# EasyEDA Pro project 02_PowerPart.epro

# Schematic Schematic2
Create Date: 2024-06-30; Page Name: P1; Project Name: 264母板; Schematic Name: Schematic2; Update Date: 2024-08-12; Company: 嘉立创EDA; Page Size: A3; Version: V1.0
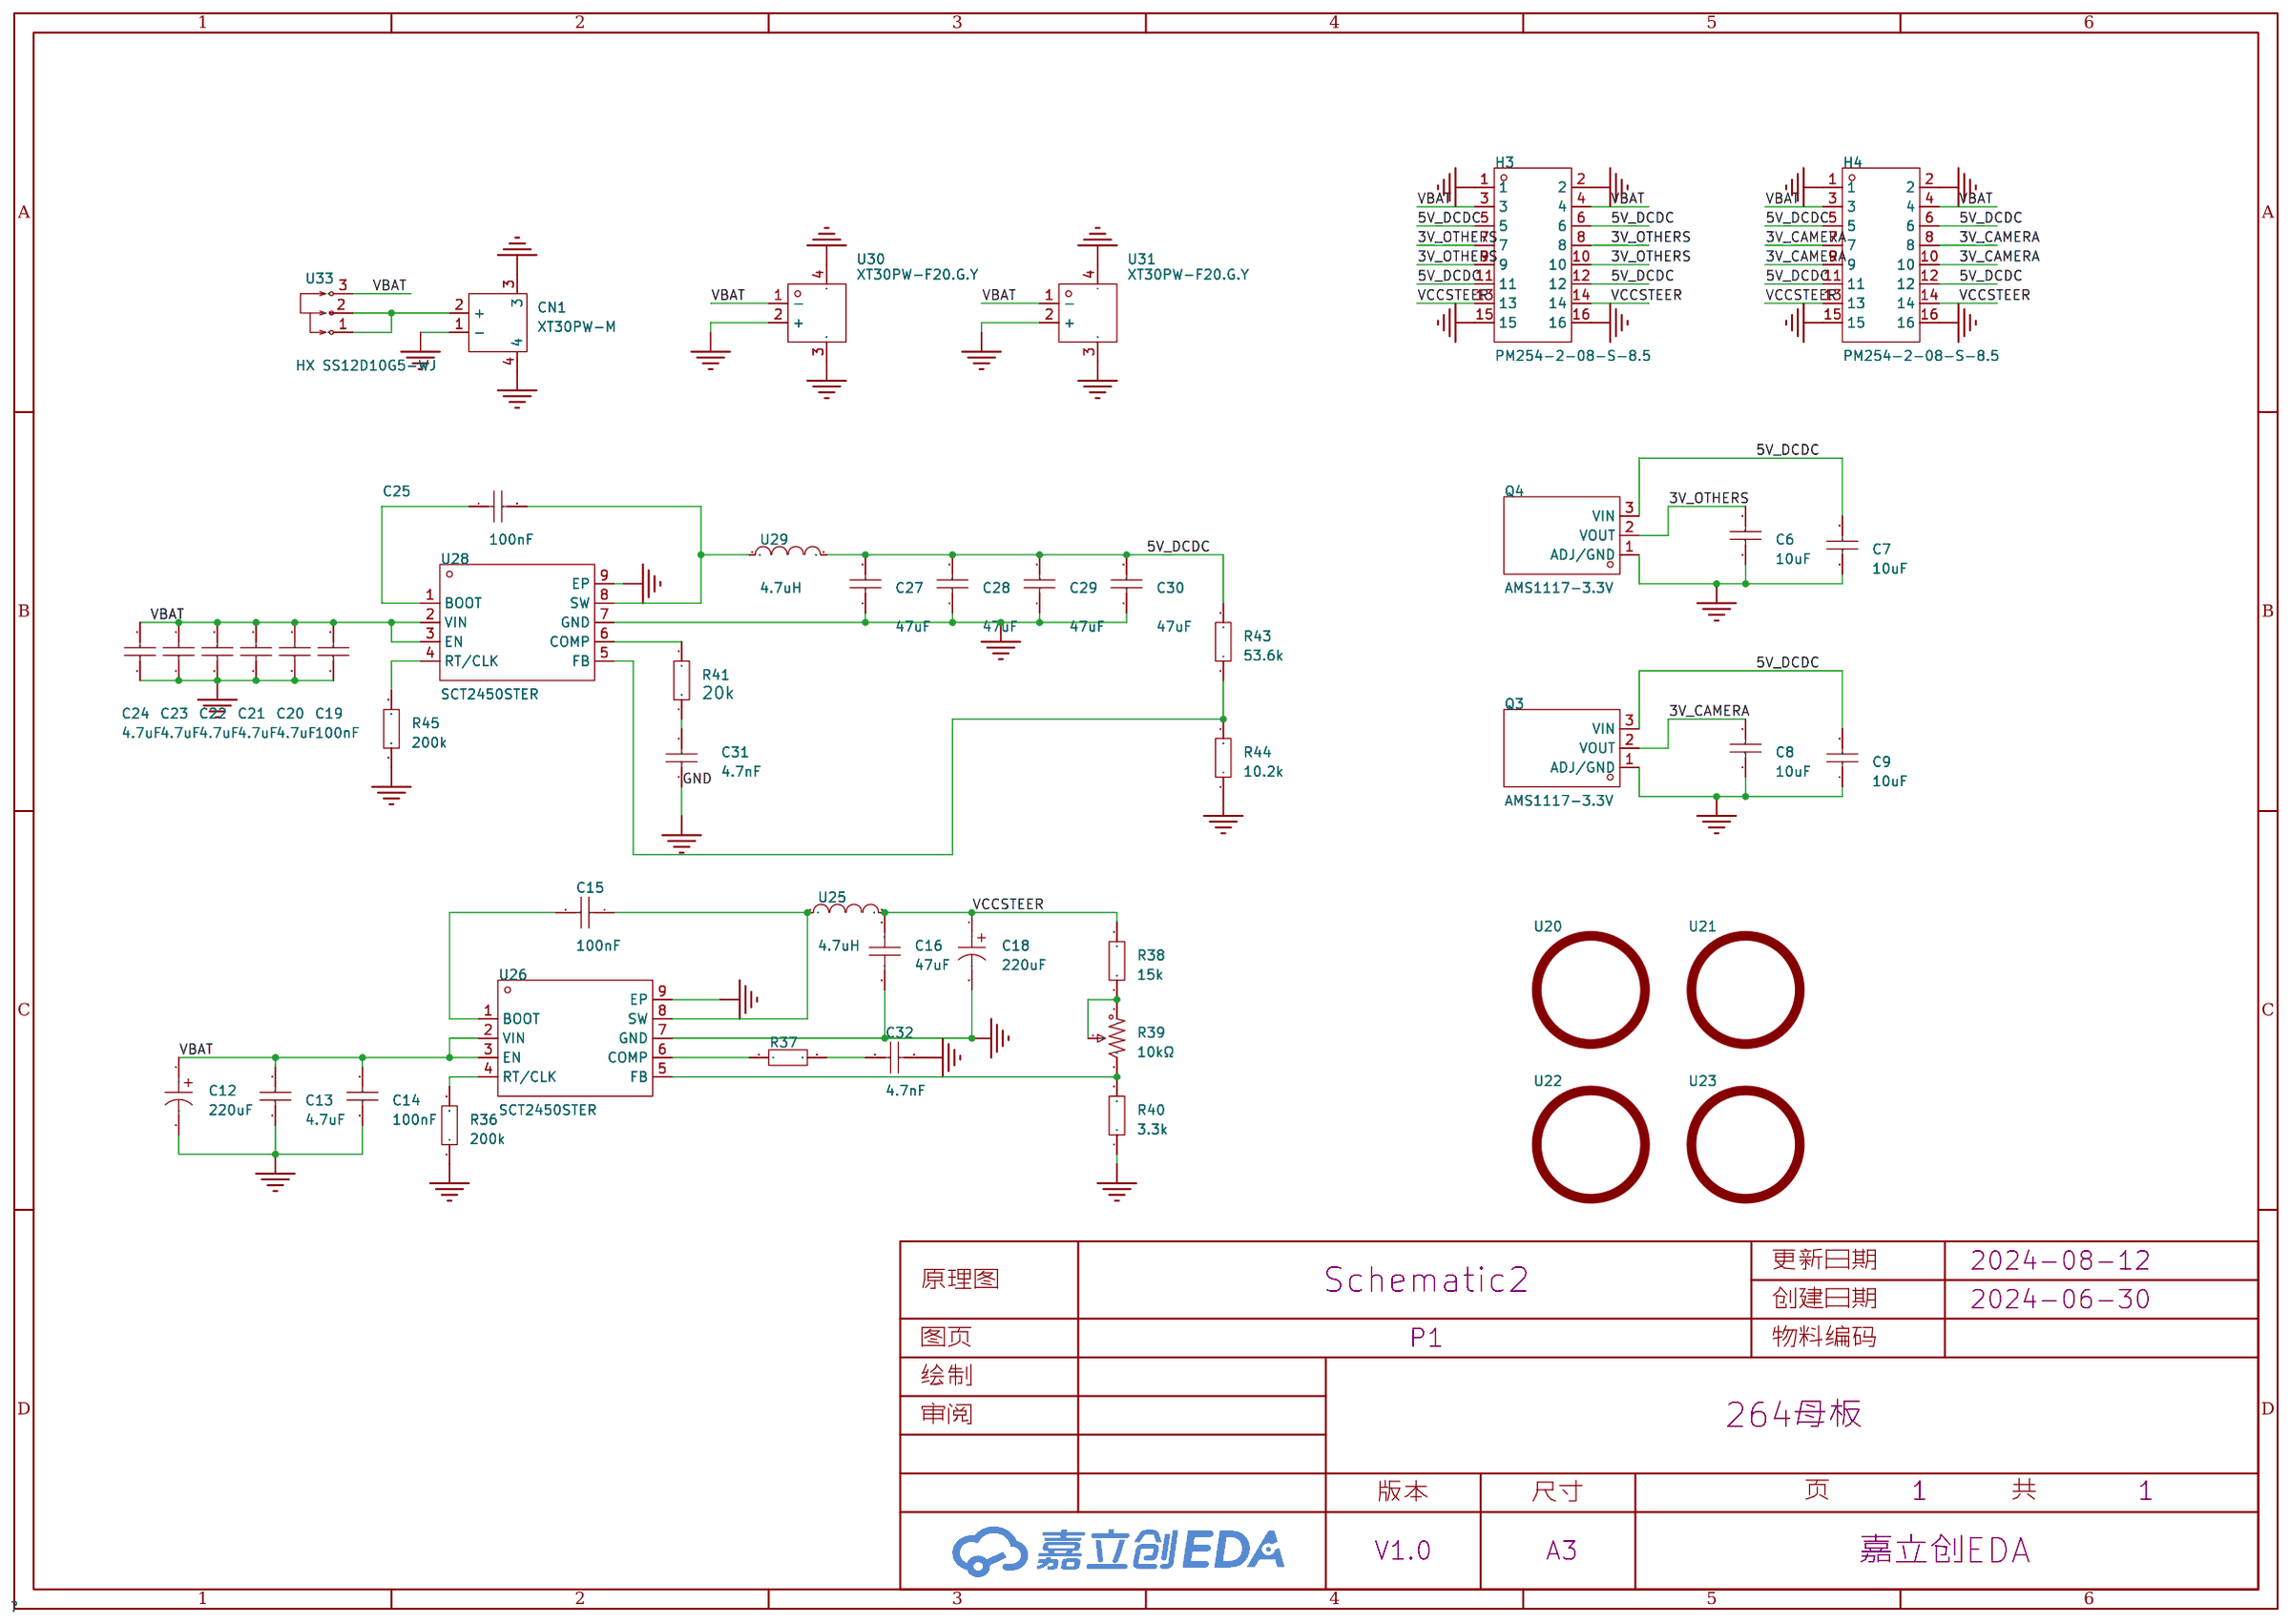
[diagram p0: schematic sheet]

## Parts
C6  10uF  [C0805]
C7  10uF  [C0805]
C8  10uF  [C0805]
C9  10uF  [C0805]
C12  220uF  [CAP-SMD_BD6.3-L6.6-W6.6-FD]
C13  4.7uF  [C0805]
C14  100nF  [C0805]
C15  100nF  [C0805]
C16  47uF  [C1206]
C18  220uF  [CAP-SMD_BD6.3-L6.6-W6.6-FD]
C19  100nF  [C0805]
C20  4.7uF  [C0805]
C21  4.7uF  [C0805]
C22  4.7uF  [C0805]
C23  4.7uF  [C0805]
C24  4.7uF  [C0805]
C25  100nF  [C0805]
C27  47uF  [C0805]
C28  47uF  [C0805]
C29  47uF  [C0805]
C30  47uF  [C0805]
C31  4.7nF  [C0805]
C32  4.7nF  [C0805]
CN1  XT30PW-M  [CONN-TH_XT30PW-M]
H3  PM254-2-08-S-8.5  [HDR-SMD_16P-P2.54-V-F-R2-C8-LS7.1]
H4  PM254-2-08-S-8.5  [HDR-SMD_16P-P2.54-V-F-R2-C8-LS7.1]
Q3  AMS1117-3.3V  [SOT-89-3_L4.5-W2.5-P1.50-LS4.2-BR]
Q4  AMS1117-3.3V  [SOT-89-3_L4.5-W2.5-P1.50-LS4.2-BR]
R36  200k  [R0805]
R37  20k  [R0805]
R38  15k  [R0805]
R39  10kΩ  [RES-ADJ-TH_3P-L10.0-W10.0-P2.50-L]
R40  3.3k  [R0805]
R41  20k  [R0805]
R43  53.6k  [R0603]
R44  10.2k  [R0603]
R45  200k  [R0805]
U20  -  [固定孔]
U21  -  [固定孔]
U22  -  [固定孔]
U23  -  [固定孔]
U25  4.7uH  [IND-SMD_L7.2-W6.6_GPSR07X0]
U26  SCT2450STER  [ESOP-8_L4.9-W3.9-P1.27-LS6.0-BL-EP]
U28  SCT2450STER  [ESOP-8_L4.9-W3.9-P1.27-LS6.0-BL-EP]
U29  4.7uH  [IND-SMD_L7.2-W6.6_GPSR07X0]
U30  XT30PW-F20.G.Y  [CONN-TH_XT30PW-F-1]
U31  XT30PW-F20.G.Y  [CONN-TH_XT30PW-F-1]
U33  HX SS12D10G5-WJ  [SW-TH_3P-P4.80_HX-SS12D10G5-WJ]

## Library data of the parts
C6-C9 C14 C15 C19-C25 C27-C32 = 电容-0805C
C12 C18 = RVT220UF16V67RV0015: 容值:220uF;精度:±20%;额定电压:16V;纹波电流:110mA@120Hz;等效串联电阻:-;; LCSC Part Name: 220uF ±20% 16V; Supplier Part: C2887273; Manufacturer: KNSCHA(科尼盛); Supplier Footprint: SMD,D6.3xL7.7mm; JLCPCB Part Class: 扩展库; Datasheet: https://atta.szlcsc.com/upload/public/pdf/source/20210824/3DC9999D9B098FE241E3A26137981C4C.pdf; Supplier: LCSC; Tolerance: ±20%; Rated Voltage: 16V; Ripple Current: 110mA@120Hz; φD: 6.3mm; L: 7.7mm; Lifetime @ Temp: 2000hrs@105℃; Operating Temperature: -55℃~+105℃
C13 = 电容-0805C: 50V
C16 = CL31A476MPHNNNE: 容值:47uF;精度:±20%;额定电压:10V;材质(温度系数):X5R;; LCSC Part Name: 47uF ±20% 10V; Supplier Part: C96123; Manufacturer: SAMSUNG(三星); Supplier Footprint: 1206; JLCPCB Part Class: 基础库; Datasheet: https://atta.szlcsc.com/upload/public/pdf/source/20160218/1457707763339.pdf; Supplier: LCSC; Tolerance: ±20%; Voltage Rated: 10V; Temperature Coefficient: X5R
CN1 = XT30PW-M: 类别:-;类型1:-;; LCSC Part Name: AMASS(艾迈斯)航模插头 卧式弯脚 XT30PW-M公头; Supplier Part: C431092; Manufacturer: AMASS(艾迈斯); Datasheet: https://atta.szlcsc.com/upload/public/pdf/source/20220222/6A9F22F7850E25B33E1BE430ADF8560B.pdf; Supplier: LCSC; Brand: 艾迈斯; Type: 航模插头; RatedVoltage: DC 500V; InterfaceType: 公头; RatedCurrent: 15A; RecommendedWireGauge: 16/18/20AWG; contact resistance: 1.2mΩ; specifications: 2pin
H3 H4 = PM254-2-08-S-8.5: 插孔结构:2x8P;间距:2.54mm;行距:2.54mm;圆孔/方孔:方孔;安装类型:立贴;排数:双排;总孔位数:16P;额定电流:3A;插孔方向:顶部;塑高:8.5mm;触头材质:铜合金;工作温度范围:-40℃~+105℃;焊接温度(最大值):260℃@5S;; LCSC Part Name: 2x8P 间距:2.54mm 立贴; Supplier Part: C3975153; Manufacturer: HCTL(华灿天禄); Supplier Footprint: SMD,P=2.54mm; Datasheet: https://atta.szlcsc.com/upload/public/pdf/source/20230609/7C6F8D8E301C6BBC8F19D55951C36597.pdf; Supplier: LCSC; Holes Structure: 2x8P; Pitch: 2.54mm; Row Spacing: 2.54mm; Circular Hole / Square Hole: 方孔; Mounting Type: 立贴; Number of Rows: 双排; Number of Holes: 16P; Current Rating (Max): 3A; Holes Direction: 顶部; Insulation Height: 8.5mm; Contact Material: 铜合金; Operating Temperature Range: -40℃~+105℃; Soldering Temperature(Max): 260℃@5S
Q3 Q4 = AMS1117-3.3V_C5120796: 输出类型:固定;最大输入电压:18V;输出电压:3.3V;最大输出电流:1A;输出极性:正极;; LCSC Part Name: 输入18V 输出3.3V 1A; Supplier Part: C5120796; Manufacturer: MSKSEMI(美森科); Supplier Footprint: SOT-89; JLCPCB Part Class: 扩展库; Datasheet: https://atta.szlcsc.com/upload/public/pdf/source/20231123/6117526697EB8BF6175FDEEBA0877266.pdf; Supplier: LCSC; Output Type: 固定; Maximum Input Voltage: 18V; Output Voltage: 3.3V; MAX Output Current: 1A; Dropout Voltage: 1.4V@(1A); standby current: 12mA; Operating Temperature: 0℃~+125℃; Output Polarity: 正极; Number of Outputs: 1
R36-R38 R40 R41 R45 = 电阻_0805: 电阻类型:厚膜电阻;阻值:1kΩ;精度:±1%;功率:125mW;温度系数:±100ppm/℃;最大工作电压:150V;工作温度范围:-55℃~+155℃;
R39 = 3296W-1-103: 阻值:10kΩ;精度:±10%;; LCSC Part Name: 10kΩ ±10%; Supplier Part: C118954; Manufacturer: BOCHEN(博晨); Supplier Footprint: 插件; JLCPCB Part Class: 扩展库; Datasheet: https://atta.szlcsc.com/upload/public/pdf/source/20171114/C118954_15106326646611117443.pdf; Supplier: LCSC; Tolerance: ±10%
R43 R44 = 0603WAF1002T5E: 电阻类型:厚膜电阻;阻值:10kΩ;精度:±1%;功率:100mW;最大工作电压:75V;温度系数:±100ppm/℃;; LCSC Part Name: 厚膜电阻 10kΩ ±1% 100mW; Supplier Part: C25804; Manufacturer: UNI-ROYAL(厚声); Supplier Footprint: 0603; JLCPCB Part Class: Basic Part; Datasheet: https://atta.szlcsc.com/upload/public/pdf/source/20200306/C422600_1E6D84923E4A46A82E41ADD87F860B5C.pdf; Supplier: LCSC; Type: 厚膜电阻; Tolerance: ±1%; Power(Watts): 100mW; Overload Voltage (Max): 75V; Temperature Coefficient: ±100ppm/℃; Operating Temperature Range: -55℃~+155℃
U20-U23 = 固定孔
U25 U29 = CYA0630-4.7UH: 电感值:4.7uH;精度:±20%;额定电流:5A;直流电阻(DCR):34.5mΩ;; LCSC Part Name: 4.7uH ±20%; Supplier Part: C5189748; Manufacturer: SHOU HAN(首韩); Supplier Footprint: SMD,7.2x6.6mm; JLCPCB Part Class: 扩展库; Datasheet: https://atta.szlcsc.com/upload/public/pdf/source/20221010/79ACBE86DD414F23A670753564343C1B.pdf; Supplier: LCSC; Tolerance: ±20%; Rated Current: 5A; DC Resistance (DCR): 34.5mΩ
U26 U28 = SCT2450STER: LCSC Part Name: 电源IC; Supplier Part: C509400; Manufacturer: SCT(芯洲科技); Supplier Footprint: ESOP-8; JLCPCB Part Class: 扩展库; Datasheet: https://atta.szlcsc.com/upload/public/pdf/source/20200407/C509400_EDF779A672A59398CFBA9E95FA584FEC.pdf; Supplier: LCSC
U30 U31 = XT30PW-F20.G.Y: 类别:-;类型1:-;; LCSC Part Name: AMASS(艾迈斯)电源连接器 母头 XT30PW-F; Supplier Part: C2913282; Manufacturer: AMASS(艾迈斯); JLCPCB Part Class: 扩展库; Datasheet: https://atta.szlcsc.com/upload/public/pdf/source/20231218/06CFCF98887A9A87638B0856A725C8FD.pdf; Supplier: LCSC; Type: 航模插头; InterfaceType: 母头
U33 = HX SS12D10G5-WJ: 电路结构:单刀双掷;额定电流(DC):2A;额定电压(DC):125V;机械寿命:3千次;; LCSC Part Name: 两档卧式插件 3脚拨动开关弯插 柄长5.0mm; Supplier Part: C19189124; Manufacturer: hanxia(韩下); Supplier Footprint: 插件-3P,6.7x12.7mm; Datasheet: https://atta.szlcsc.com/upload/public/pdf/source/20231103/2145BED94D895C5D893F8C98A4AF28EC.pdf; Supplier: LCSC; Circuit: 单刀双掷; Switch Length: 12.7mm; Switch Width: 6.7mm; Switch Height: 6.4mm; Current Rating (DC): 2A; Voltage Rating (DC): 125V; Mechanical Life: 3千次; Operating Temperature: -25℃~+70℃

## Nets
3V_CAMERA: C8.2 H4.7 H4.8 H4.9 H4.10 Q3.2(VOUT)
3V_OTHERS: C6.2 H3.7 H3.8 H3.9 H3.10 Q4.2(VOUT)
5V_DCDC: C7.2 C9.2 C27.2 C28.2 C29.2 C30.2 H3.5 H3.6 H3.11 H3.12 H4.5 H4.6 H4.11 H4.12 Q3.3(VIN) Q4.3(VIN) R43.2 U29.2
GND: C6.1 C7.1 C8.1 C9.1 C12.2 C13.1 C14.1 C16.1 C18.2 C19.2 C20.2 C21.2 C22.2 C23.2 C24.2 C27.1 C28.1 C29.1 C30.1 C31.2 C32.2 CN1.1(-) CN1.3 CN1.4 H3.1 H3.2 H3.15 H3.16 H4.1 H4.2 H4.15 H4.16 Q3.1(ADJ/GND) Q4.1(ADJ/GND) R36.1 R40.1 R44.1 R45.1 U26.7(GND) U26.9(EP) U28.7(GND) U28.9(EP) U30.2(+) U30.3 U30.4 U31.2(+) U31.3 U31.4
VBAT: C12.1 C13.2 C14.2 C19.1 C20.1 C21.1 C22.1 C23.1 C24.1 H3.3 H3.4 H4.3 H4.4 U26.2(VIN) U26.3(EN) U28.2(VIN) U28.3(EN) U30.1(-) U31.1(-) U33.3
VCCSTEER: C16.2 C18.1 H3.13 H3.14 H4.13 H4.14 R38.2 U25.2
$1N519: C15.2 U26.1(BOOT)
$1N522: R38.1 R39.1 R39.2
$1N523: R37.1 U26.6(COMP)
$1N525: R36.2 U26.4(RT/CLK)
$1N531: C15.1 U25.1 U26.8(SW)
$1N533: C32.1 R37.2
$1N534: R39.3 R40.2 U26.5(FB)
$1N1940: C25.1 U28.1(BOOT)
$1N2024: C25.2 U28.8(SW) U29.1
$1N2144: C31.1 R41.1
$1N2372: R45.2 U28.4(RT/CLK)
$1N2486: R41.2 U28.6(COMP)
$1N2611: R43.1 R44.2 U28.5(FB)
$1N7133: CN1.2(+) U33.1 U33.2

# Board PCB3
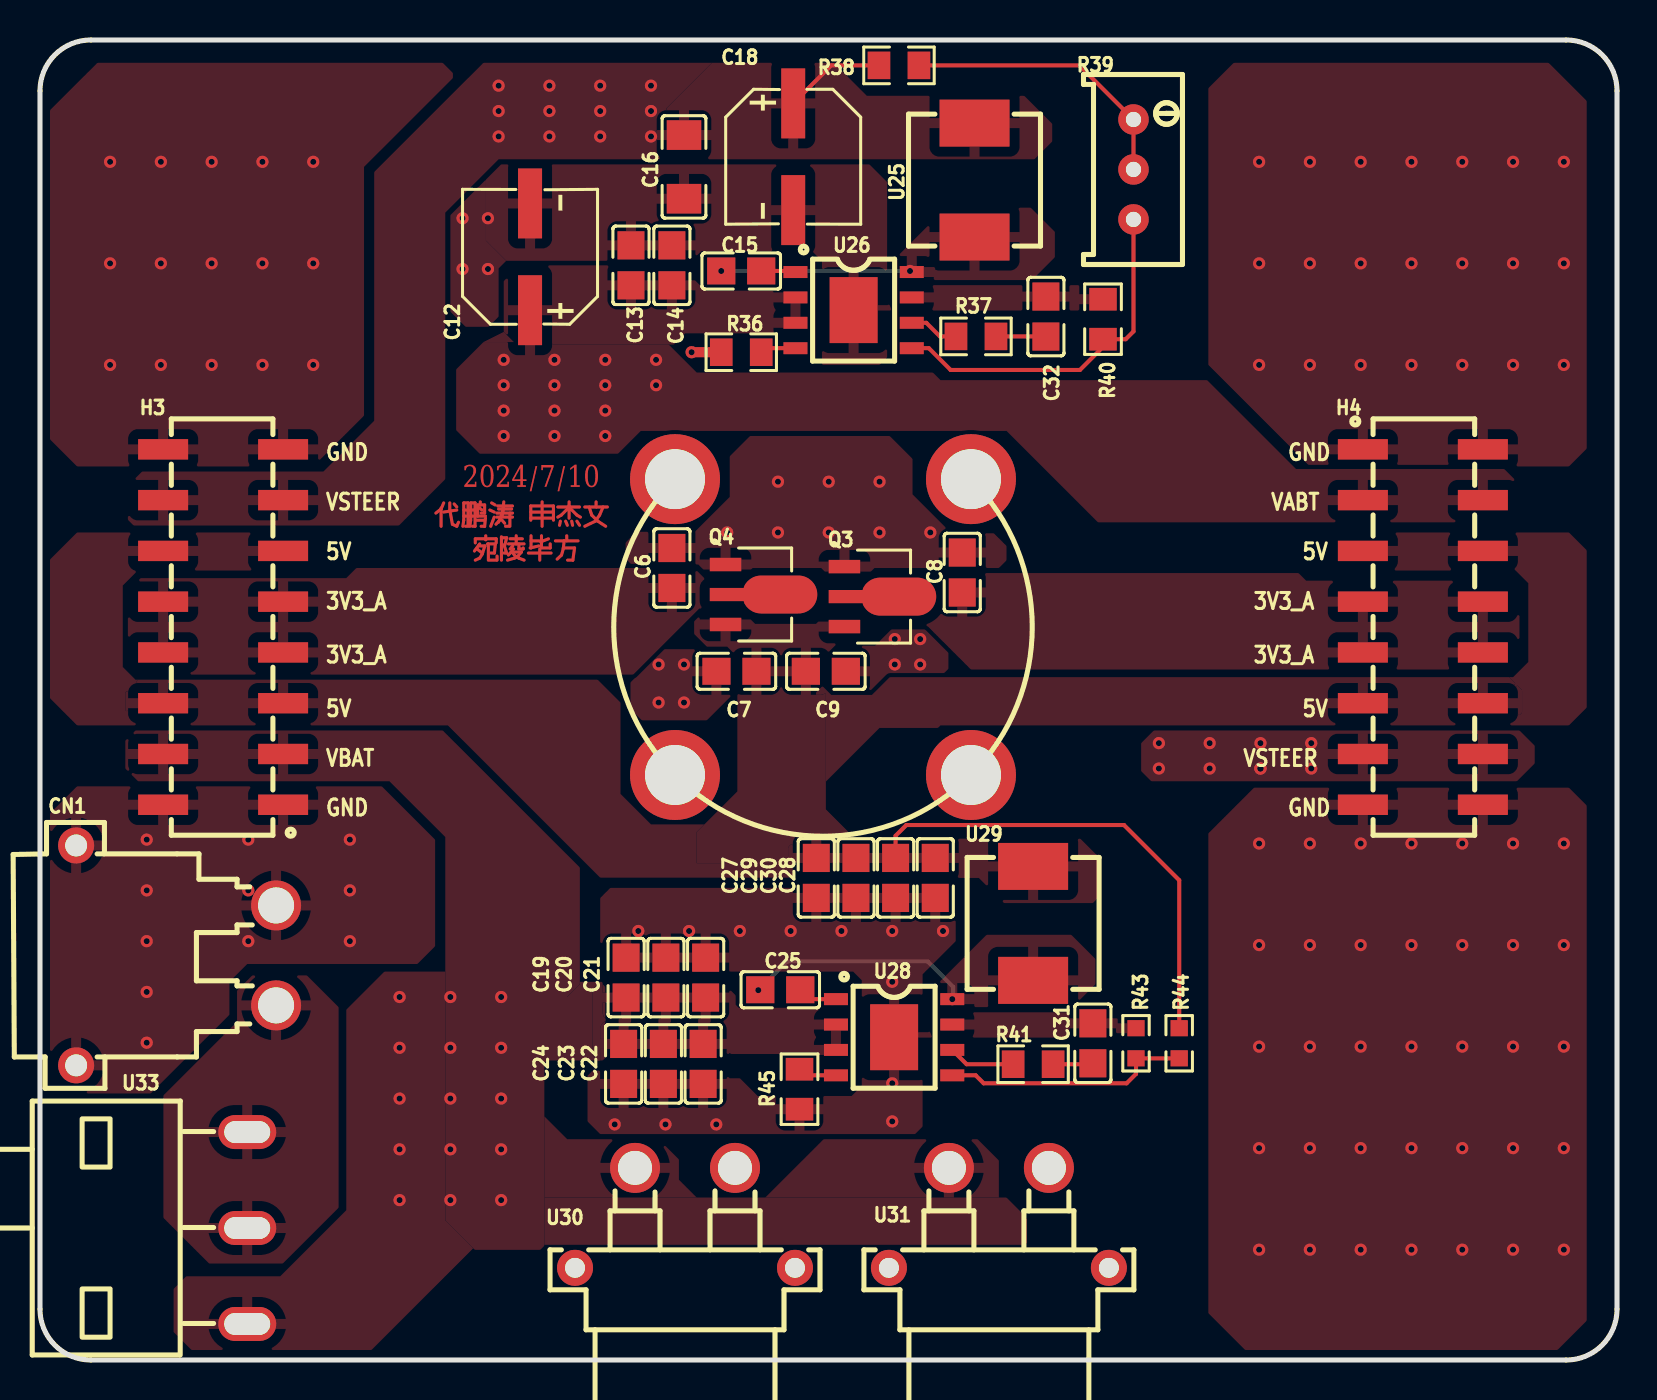
[diagram p1: board, top side]
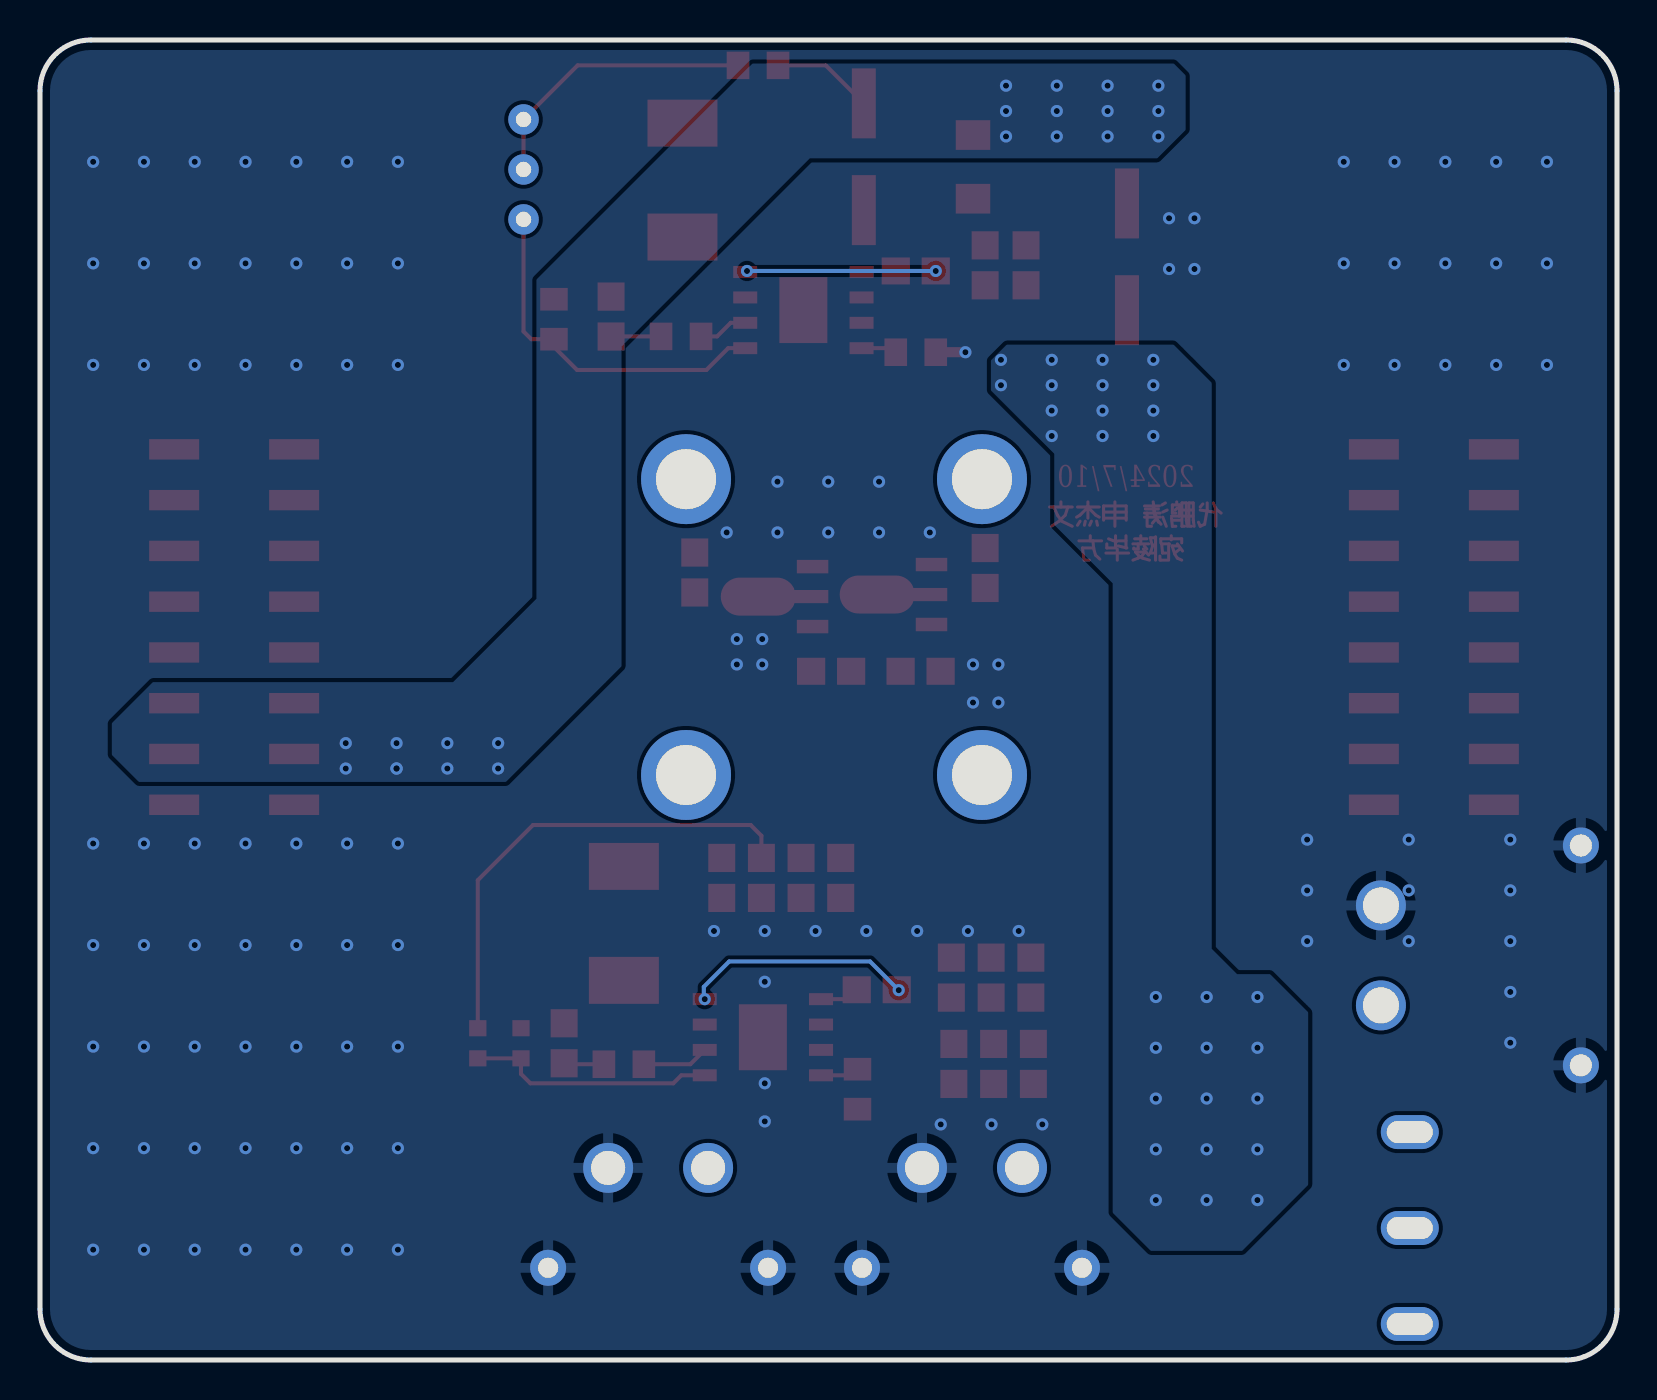
[diagram p2: board, bottom side, seen from below]

Outline 78.87 x 66.04 mm; copper layers: Top Layer, Bottom Layer. Coordinates in mm from the lower left corner of the outline.
Outline path: 0,63.5 0,2.54 arc(0.74,0.74) 2.54,0 76.33,0 arc(78.12,0.74) 78.87,2.54 78.87,63.5 arc(78.12,65.3) 76.33,66.04 2.54,66.04 arc(0.74,65.3) 0,63.5
Stack: Top Layer 0.035mm / Dielectric1 1.51mm FR4 er 4.5 / Bottom Layer 0.035mm

## Design rules (mm)
template: 自定义配置
spacing copperThickness1oz (default): track to track 0.102, other pairs 0 to 0.3
spacing copperThickness2oz: track to track 0.203, other pairs 0.152 to 0.3
track width copperThickness1oz (default): min 0.127, default 0.203, max 2.54
track width copperThickness2oz: min 0.203, default 0.254, max 2.54
differential pair differentialPair (default): width min 0.127, default 0.254, max 2.54; gap min 0.152, default 0.152
via viaSize (default): diameter min 0.5, default 0.61, max 10; hole min 0.3, default 0.305, max 6.299
net GND uses 40mil
net $1N2024 uses FULL
pour e59 uses FULL
pour e209 uses FULL
pour e333 uses FULL
pour e413 uses FULL
pour e460 uses FULL
pour e243 uses FULL
pour e96 uses FULL
pour e157 uses FULL
pour e116 uses FULL
pour e176 uses FULL
pour e287 uses FULL
pour e338 uses FULL
pour e376 uses FULL
pour e433 uses FULL
pour e439 uses FULL
pour e471 uses FULL
pour e219 uses FULL
pour e559 uses FULL
pour e605 uses FULL
pour e643 uses FULL
pour e645 uses FULL
pour e384 uses FULL
pour e925 uses FULL
pour e937 uses FULL
pour e1095 uses FULL
pour e1150 uses FULL
pour e1244 uses FULL
pour e1251 uses FULL
pour e1600 uses FULL
pour e70 uses FULL
pour e72 uses FULL
pour e292 uses FULL
pour e152 uses FULL
pour e154 uses FULL
pour e113 uses FULL

## Placement (name value [footprint] x y rotation side)
C6  10uF  [C0805]  31.6 39.62 270 top
C7  10uF  [C0805]  34.83 34.46 0 top
C8  10uF  [C0805]  46.12 39.4 270 top
C9  10uF  [C0805]  39.3 34.46 180 top
C12  220uF  [CAP-SMD_BD6.3-L6.6-W6.6-FD]  24.51 55.19 90 top
C13  4.7uF  [C0805]  29.55 54.77 270 top
C14  100nF  [C0805]  31.6 54.77 270 top
C15  100nF  [C0805]  35.07 54.48 0 top
C16  47uF  [C1206]  32.21 59.69 90 top
C18  220uF  [CAP-SMD_BD6.3-L6.6-W6.6-FD]  37.67 60.2 270 top
C19  100nF  [C0805]  29.31 19.13 90 top
C20  4.7uF  [C0805]  31.3 19.13 90 top
C21  4.7uF  [C0805]  33.29 19.13 90 top
C22  4.7uF  [C0805]  33.17 14.81 270 top
C23  4.7uF  [C0805]  31.18 14.81 270 top
C24  4.7uF  [C0805]  29.19 14.81 270 top
C25  100nF  [C0805]  37.02 18.52 180 top
C27  47uF  [C0805]  38.82 24.12 90 top
C28  47uF  [C0805]  44.77 24.12 90 top
C29  47uF  [C0805]  40.81 24.12 90 top
C30  47uF  [C0805]  42.79 24.12 90 top
C31  4.7nF  [C0805]  52.65 15.85 90 top
C32  4.7nF  [C0805]  50.31 52.2 90 top
CN1  XT30PW-M  [CONN-TH_XT30PW-M]  6.81 20.24 270 top
H3  PM254-2-08-S-8.5  [HDR-SMD_16P-P2.54-V-F-R2-C8-LS7.1]  9.16 36.67 90 top
H4  PM254-2-08-S-8.5  [HDR-SMD_16P-P2.54-V-F-R2-C8-LS7.1]  69.16 36.67 270 top
Q3  AMS1117-3.3V  [SOT-89-3_L4.5-W2.5-P1.50-LS4.2-BR]  41.59 38.19 180 top
Q4  AMS1117-3.3V  [SOT-89-3_L4.5-W2.5-P1.50-LS4.2-BR]  35.64 38.3 180 top
R36  200k  [R0805]  35.07 50.42 0 top
R37  20k  [R0805]  46.81 51.21 0 top
R38  15k  [R0805]  42.96 64.77 180 top
R39  10kΩ  [RES-ADJ-TH_3P-L10.0-W10.0-P2.50-L]  54.69 59.56 270 top
R40  3.3k  [R0805]  53.16 52.07 270 top
R41  20k  [R0805]  49.67 14.8 180 top
R43  53.6k  [R0603]  56.97 15.85 90 top
R44  10.2k  [R0603]  54.81 15.85 270 top
R45  200k  [R0805]  37.98 13.55 90 top
U20  -  [固定孔]  31.76 29.27 270 top
U21  -  [固定孔]  46.56 44.07 270 top
U22  -  [固定孔]  46.56 29.27 270 top
U23  -  [固定孔]  31.76 44.07 270 top
U25  4.7uH  [IND-SMD_L7.2-W6.6_GPSR07X0]  46.74 59.03 90 top
U26  SCT2450STER  [ESOP-8_L4.9-W3.9-P1.27-LS6.0-BL-EP]  40.69 52.53 270 top
U28  SCT2450STER  [ESOP-8_L4.9-W3.9-P1.27-LS6.0-BL-EP]  42.71 16.15 270 top
U29  4.7uH  [IND-SMD_L7.2-W6.6_GPSR07X0]  49.67 21.84 90 top
U30  XT30PW-F20.G.Y  [CONN-TH_XT30PW-F-1]  32.26 7.11 0 top
U31  XT30PW-F20.G.Y  [CONN-TH_XT30PW-F-1]  47.95 7.11 0 top
U33  HX SS12D10G5-WJ  [SW-TH_3P-P4.80_HX-SS12D10G5-WJ]  10.36 6.6 270 top

## Footprints (pads in the part's own frame, mm; a bottom-side part is the same pattern mirrored in y, then rotated)
C0805
  rect 1.41x1.35 smd: 1(-1,0) 2(1,0)
C1206
  rect 1.485x1.728 smd: 1(-1.593,0) 2(1.593,0)
CAP-SMD_BD6.3-L6.6-W6.6-FD
  rect 3.5x1.2 smd: 1(-2.67,0) 2(2.67,0)
CONN-TH_XT30PW-F-1
  round 2.5 hole 1.7: 1(-2.5,2.5) 2(2.5,2.5)
  round 1.8 hole 1: 3(5.5,-2.5) 4(-5.5,-2.5)
CONN-TH_XT30PW-M
  round 2.5 hole 1.8: 1(-2.5,5) 2(2.5,5)
  round 1.8 hole 1.1: 3(5.5,-5) 4(-5.5,-5)
ESOP-8_L4.9-W3.9-P1.27-LS6.0-BL-EP
  rect 0.6x1.2 smd: 1(-1.905,-2.909) 2(-0.635,-2.909) 3(0.635,-2.909) 4(1.905,-2.909) 5(1.905,2.909) 6(0.635,2.909) 7(-0.635,2.909) 8(-1.905,2.909)
  rect 3.3x2.4 smd: 9(0,0)
HDR-SMD_16P-P2.54-V-F-R2-C8-LS7.1
  rect 1.02x2.5 smd: 1(-8.89,-3) 2(-8.89,3) 3(-6.35,-3) 4(-6.35,3) 5(-3.81,-3) 6(-3.81,3) 7(-1.27,-3) 8(-1.27,3) 9(1.27,-3) 10(1.27,3) 11(3.81,-3) 12(3.81,3) 13(6.35,-3) 14(6.35,3) 15(8.89,-3) 16(8.89,3)
IND-SMD_L7.2-W6.6_GPSR07X0
  rect 2.35x3.5 smd: 1(-2.85,0) 2(2.85,0)
R0603
  rect 0.806x0.864 smd: 1(-0.753,0) 2(0.753,0)
R0805
  rect 1.133x1.377 smd: 1(-1,0) 2(1,0)
RES-ADJ-TH_3P-L10.0-W10.0-P2.50-L
  round 1.524 hole 0.762: 1(-2.5,0) 2(0,0) 3(2.5,0)
SOT-89-3_L4.5-W2.5-P1.50-LS4.2-BR
  rect 1.575x0.672 smd: 1(1.356,-1.5) 3(1.356,1.5)
  custom 5.377x1.9 smd: 2(-1.356,0)
SW-TH_3P-P4.80_HX-SS12D10G5-WJ
  oval 1.7x2.9 hole 1.1x2.3: 1(-4.8,0) 2(0,0) 3(4.8,0)
固定孔
  round 4.5 hole 3: 1(0,0)

## Nets
As in the schematic.

Pads without a net: U20 1; U21 1; U22 1; U23 1

## Via types
v1: diameter 0.61, hole 0.305, Top Layer to Bottom Layer, 170 vias

## Routing (per net, layer and track width the routed paths; a pad name or vN(x,y) marks a point on that pad's centre or on a via; arc(x,y) is an arc through that point)
5V_DCDC: length 24.1
  Top Layer w0.203: C30.2 42.79,26.23 43.33,26.76 54.21,26.76 56.97,24 R43.2
GND: length 1.5
  Top Layer w0.508: R36.1 v1(32.59,50.42)
  vias: v1(3.5,59.94) v1(3.5,54.86) v1(3.5,49.78) v1(5.34,26.03) v1(5.34,23.49) v1(5.34,20.95) v1(5.34,18.41) v1(5.34,15.87) v1(6.05,59.94) v1(6.05,54.86) v1(6.05,49.78) v1(8.58,59.94) v1(8.58,54.86) v1(8.58,49.78) v1(10.42,26.03) v1(10.42,23.49) v1(10.42,20.95) v1(11.12,59.94) v1(11.12,54.86) v1(11.12,49.78) v1(13.66,59.94) v1(13.66,54.86) v1(13.66,49.78) v1(15.5,26.03) v1(15.5,23.49) v1(15.5,20.95) v1(21.13,57.12) v1(21.13,54.58) v1(22.4,57.12) v1(22.4,54.58) v1(28.74,11.79) v1(29.92,21.46) v1(30.94,34.8) v1(30.94,32.89) v1(31.28,11.79) v1(32.21,34.8) v1(32.21,32.89) v1(32.46,21.46) v1(33.82,11.79) v1(34.37,41.4) v1(35,21.46) v1(36.91,43.94) v1(36.91,41.4) v1(37.54,21.46) v1(39.45,43.94) v1(39.45,41.4) v1(40.08,21.46) v1(41.99,43.94) v1(41.99,41.4) v1(42.62,21.46) v1(42.62,18.92) v1(42.62,13.84) v1(42.62,11.94) v1(42.75,36.07) v1(42.75,34.8) v1(44.02,36.07) v1(44.02,34.8) v1(44.53,41.4) v1(45.16,21.46) v1(60.97,59.94) v1(60.97,54.86) v1(60.97,49.78) v1(60.97,25.84) v1(60.97,20.76) v1(60.97,15.68) v1(60.97,10.6) v1(60.97,5.52) v1(63.51,59.94) v1(63.51,54.86) v1(63.51,49.78) v1(63.51,25.84) v1(63.51,20.76) v1(63.51,15.68) v1(63.51,10.6) v1(63.51,5.52) v1(66.05,59.94) v1(66.05,54.86) v1(66.05,49.78) v1(66.05,25.84) v1(66.05,20.76) v1(66.05,15.68) v1(66.05,10.6) v1(66.05,5.52) v1(68.59,59.94) v1(68.59,54.86) v1(68.59,49.78) v1(68.59,25.84) v1(68.59,20.76) v1(68.59,15.68) v1(68.59,10.6) v1(68.59,5.52) v1(71.13,59.94) v1(71.13,54.86) v1(71.13,49.78) v1(71.13,25.84) v1(71.13,20.76) v1(71.13,15.68) v1(71.13,10.6) v1(71.13,5.52) v1(73.67,59.94) v1(73.67,54.86) v1(73.67,49.78) v1(73.67,25.84) v1(73.67,20.76) v1(73.67,15.68) v1(73.67,10.6) v1(73.67,5.52) v1(76.21,59.94) v1(76.21,54.86) v1(76.21,49.78) v1(76.21,25.84) v1(76.21,20.76) v1(76.21,15.68) v1(76.21,10.6) v1(76.21,5.52)
VBAT:
  vias: v1(17.98,18.16) v1(17.98,15.62) v1(17.98,13.08) v1(17.98,10.54) v1(17.98,8) v1(20.52,18.16) v1(20.52,15.62) v1(20.52,13.08) v1(20.52,10.54) v1(20.52,8) v1(23.06,18.16) v1(23.06,15.62) v1(23.06,13.08) v1(23.06,10.54) v1(23.06,8) v1(23.19,50.04) v1(23.19,48.77) v1(23.19,47.5) v1(23.19,46.23) v1(25.73,50.04) v1(25.73,48.77) v1(25.73,47.5) v1(25.73,46.23) v1(28.27,50.04) v1(28.27,48.77) v1(28.27,47.5) v1(28.27,46.23) v1(30.81,50.04) v1(30.81,48.77)
VCCSTEER: length 5.1
  Top Layer w0.203: R38.2 39.57,64.77 C18.1
  vias: v1(22.94,63.75) v1(22.94,62.48) v1(22.94,61.21) v1(25.48,63.75) v1(25.48,62.48) v1(25.48,61.21) v1(28.02,63.75) v1(28.02,62.48) v1(28.02,61.21) v1(30.56,63.75) v1(30.56,62.48) v1(30.56,61.21) v1(55.96,30.86) v1(55.96,29.59) v1(58.5,30.86) v1(58.5,29.59) v1(61.04,30.86) v1(61.04,29.59) v1(61.04,29.59) v1(63.58,30.86) v1(63.58,29.59)
$1N519: length 1.7
  Top Layer w0.203: C15.2 37.73,54.48 U26.1
$1N522: length 14.3
  Top Layer w0.203: R38.1 51.98,64.77 R39.1 R39.2
$1N523: length 2.5
  Top Layer w0.203: U26.6 44.32,51.89 45.01,51.21 R37.1
$1N525: length 1.8
  Top Layer w0.203: U26.4 36.27,50.62 R36.2
$1N531: length 9.4
  Bottom Layer w0.203: v1(43.51,54.48) v1(34.07,54.48)
$1N533: length 2.5
  Top Layer w0.203: C32.1 50.3,51.21 R37.2
$1N534: length 17.8
  Top Layer w0.203: U26.5 44.45,50.62 45.54,49.53 52.01,49.53 53.16,50.69 ; R40.2 54.3,51.07 54.69,51.46 R39.3
$1N1940: length 2
  Top Layer w0.203: C25.1 38.49,18.05 U28.1
$1N2024: length 11.5
  Bottom Layer w0.203: 45.67,18.03 45.67,18.67 44.4,19.94 37.36,19.94 v1(35.92,18.5)
  vias: v1(45.62,18.05)
$1N2144: length 2
  Top Layer w0.203: R41.1 52.61,14.8 C31.1
$1N2372: length 1.9
  Top Layer w0.203: U28.4 38.29,14.24 R45.2
$1N2486: length 3.3
  Top Layer w0.203: R41.2 46.34,14.8 U28.6
$1N2611: length 12.5
  Top Layer w0.203: U28.5 46.79,14.24 47.19,13.84 54.34,13.84 54.81,14.31 R44.2 R43.1

## Copper pours and planes (outline as drawn; the poured copper is in the pictures)
3V_CAMERA on Top Layer: 41.1,38.48 41.99,39.37 62.94,39.37 63.32,38.99 73.48,38.99 73.99,38.48 73.99,35.05 73.48,34.54 46.56,34.54 44.4,36.7 42.37,36.7 41.22,37.85 41.22,38.35
3V_OTHERS on Top Layer: 4.39,38.48 4.39,34.92 5.03,34.29 29.67,34.29 32.97,37.59 35.38,37.59 35.89,37.08 38.68,37.08 39.19,37.59 39.19,38.86 38.56,39.5 35.89,39.5 35.26,38.86 33.48,38.86 32.71,39.62 15.82,39.62 15.32,39.12 5.03,39.12
5V_DCDC on Top Layer: 39.19,26.8 30.56,26.8 29.03,28.32 29.03,32.89 27.89,34.04 4.9,34.04 4.27,33.4 4.27,32.51 5.03,31.75 20.4,31.75 28.02,24.13 40.58,24.13 40.81,24.36 40.81,25.18
5V_DCDC on Top Layer: 37.41,25.65 37.84,26.08 52.03,26.08 52.97,25.14 52.97,23.17 52.65,22.86 48.21,22.86 46.95,24.12 37.81,24.12 37.41,24.51
5V_DCDC on Top Layer: 73.67,34.16 74.43,34.92 74.43,38.86 73.8,39.5 65.03,39.5 64.4,40.13 64.4,40.77 65.03,41.4 76.46,41.4 77.35,40.51 77.35,32.64 76.46,31.75 70.75,31.75 70.24,32.26 72.14,34.16
5V_DCDC on Top Layer: 4.77,34.04 4.14,34.67 4.14,38.75 4.89,39.5 13.28,39.5 13.92,40.13 13.92,40.77 13.28,41.4 1.85,41.4 0.33,39.88 0.33,33.27 1.85,31.75 7.57,31.75 8.08,32.26 6.3,34.04
5V_DCDC on Top Layer: 35.26,37.34 35.76,36.83 38.81,36.83 39.32,37.34 41.22,37.34 41.48,37.08 41.48,36.46 40.88,35.87 39.89,35.87 39.3,35.28 39.3,27.55 41.56,25.29 41.56,24.86 32.84,24.86 32.84,26.42 34.87,28.45 34.87,35.18 34.37,35.69 33.35,35.69 32.71,36.32 32.71,36.96 33.1,37.34
5V_DCDC on Top Layer: 38.81,28.45 41.99,31.62 44.91,31.62 45.03,31.75 73.48,31.75 74.12,32.38 74.12,33.53 73.48,34.16 42.49,34.16 41.61,33.27 39.57,33.27 39.13,33.72 38.81,33.4
GND on Top Layer: 1.85,28.7 17.09,28.7 19.76,26.03 19.76,20.7 18.87,19.81 10.36,19.81 9.47,18.92 9.47,17.27 5.54,13.33 1.3,13.33 0.26,14.38 0.26,27.1
GND on Top Layer: 76.46,28.63 60.71,28.63 58.43,26.35 58.43,2.34 60.33,0.44 75.83,0.44 77.35,1.96 77.35,27.74
GND on Top Layer: 41.36,53.39 41.74,53.78 54.06,53.78 54.06,52.51 41.36,52.51
GND on Top Layer: 22.3,59.05 23.06,59.82 41.48,59.82 42.37,58.93 42.37,50.16 41.99,49.78 39.11,49.78 39.11,54.98 38.61,55.47 33.07,55.47 32.59,54.99 23.32,54.99 22.3,56.01
GND on Top Layer: 22.3,59.05 20.52,57.28 20.52,52.45 21.28,51.69 22.43,51.69 22.94,52.2 22.94,54.61 23.32,54.99 23.32,58.04
GND on Top Layer: 1.85,44.7 13.66,44.7 16.2,47.24 16.2,59.69 20.65,64.13 20.65,64.39 20.14,64.9 2.87,64.9 0.33,62.36 0.33,46.23
GND on Top Layer: 28.52,19.43 28.02,19.94 28.02,23.11 28.52,23.62 45.36,23.62 45.8,23.19 45.8,20.95 44.14,19.3 44.14,11.68 43.76,11.3 28.02,11.3 27.38,11.94 27.38,14.22 27.64,14.48 34.11,14.48 34.49,14.1 35,14.1 35.89,13.21 40.59,13.21 41.1,13.72 41.1,19 40.66,19.43
GND on Top Layer: 32.92,39.8 33.6,39.12 35.13,39.12 35.64,39.62 39.06,39.62 39.83,38.86 40.97,38.86 41.73,39.62 47.95,39.62 48.34,40 48.34,40.73 47.7,41.36 45.58,41.36 43.64,43.31 43.64,45.08 42.49,46.23 35.51,46.23 34.49,45.21 34.49,43.18 32.75,41.43 29.83,41.43 29.29,40.89 29.29,40.09 29.58,39.8
GND on Top Layer: 31.19,35.56 34.11,35.56 34.62,35.05 34.62,33.27 33.35,32 30.1,32 29.53,32.57 29.53,33.9
GND on Top Layer: 39.51,35.21 40.05,35.74 41.76,35.74 42.58,36.55 44.27,36.55 45.43,35.39 45.43,34.58 45.11,34.26 42.31,34.26 41.48,33.43 39.67,33.43 39.51,33.59
GND on Top Layer: 76.46,44.7 63.51,44.7 58.43,49.78 58.43,63.63 59.7,64.9 75.45,64.9 77.35,62.99 77.35,45.59
GND on Top Layer: 43.38,17.02 43.76,17.4 55.26,17.4 55.26,16.13 43.38,16.13
GND on Bottom Layer: -4.88,69.21 81.81,69.21 81.81,-2.92 -4.88,-2.92
VBAT on Top Layer: 25.09,12.32 26.36,11.05 30.94,11.05 31.95,10.03 31.95,9.02 33.1,7.87 24.54,7.87 24.54,11.76
VBAT on Top Layer: 20.27,18.16 20.27,26.16 17.47,28.96 4.9,28.96 4.27,29.59 4.27,30.99 4.77,31.5 20.14,31.5 27,24.64 27,18.8 26.36,18.16
VBAT on Top Layer: 39.83,17.53 40.33,17.53 40.84,17.02 40.84,15.49 40.33,14.99 39.23,14.99 38.9,15.31 34.55,15.31 34.49,15.37 33.94,14.81 28.06,14.81 27.64,15.24 27.64,18.54 28.02,18.92 34.11,18.92 34.79,18.24 34.79,17.77 34.94,17.62 39.73,17.62
VBAT on Top Layer: 23.98,54.77 32.18,54.77 32.71,54.23 32.71,54.06 33.28,53.5 38.37,53.5 38.64,53.23 38.64,51.69 38.31,51.36 32.26,51.36 31.7,50.8 23.83,50.8 23.19,51.43 23.19,53.97
VBAT on Top Layer: 24.84,8.13 48.34,8.13 49.35,7.11 49.35,5.77 24.67,5.77 23.95,6.49 24.84,7.37
VBAT on Top Layer: 36.14,8 39.19,11.05 46.89,11.05 47.95,9.98 47.95,8 47.45,7.49 36.65,7.49
VBAT on Top Layer: 17.22,19.43 15.32,17.53 15.32,7.49 12.01,4.19 7.31,4.19 6.68,3.56 6.68,1.4 7.7,0.38 16.46,0.38 22.17,6.1 22.17,17.78 20.52,19.43
VBAT on Top Layer: 20.27,6.98 20.27,18.16 21.03,18.92 28.02,18.92 28.27,18.67 28.27,15.11 28.14,14.99 25.35,14.99 25.22,14.86 25.22,5.71 25.02,5.51 21.74,5.51
VBAT on Top Layer: 31.32,50.93 32.84,49.4 44.65,49.4 45.03,49.02 58.37,49.02 62.81,44.58 73.23,44.58 73.74,44.07 73.74,42.42 73.23,41.91 52.91,41.91 48.34,46.48 30.05,46.48 28.9,45.34 21.99,45.34 20.81,46.52 20.81,49.56 22.18,50.93
VBAT on Bottom Layer: 15.44,8.76 15.44,17.4 17.35,19.3 19,19.3 20.27,20.57 20.27,48.89 22.18,50.8 30.52,50.8 31.31,50.01 31.31,48.51 28.14,45.34 28.14,41.78 25.22,38.86 25.22,7.37 23.32,5.46 18.74,5.46
VCCSTEER on Top Layer: 31.45,60.07 30.81,60.71 30.81,62.1 33.6,64.9 39.7,64.9 41.35,63.25 49.23,63.25 50.62,61.85 50.62,60.96 49.73,60.07
VCCSTEER on Top Layer: 33.98,64.9 22.17,64.9 16.71,59.44 16.71,46.99 14.17,44.45 5.11,44.45 4.39,43.74 4.39,42.04 4.68,41.75 17.95,41.75 20.27,44.07 20.27,57.4 22.94,60.07 32.22,60.07 33.98,61.83
VCCSTEER on Top Layer: 55.58,28.96 73.86,28.96 74.75,29.84 74.75,30.73 73.99,31.5 55.7,31.5 55.07,30.86 55.07,29.46
VCCSTEER on Bottom Layer: 21.57,64.27 21.57,61.54 22.99,60.12 40.37,60.12 49.78,50.7 49.78,34.7 55.56,28.92 73.92,28.92 75.27,30.27 75.27,31.86 73.22,33.91 58.21,33.91 54.04,38.08 54.04,54.05 43.23,64.86 22.16,64.86
$1N531 on Top Layer: 45.31,57.65 49.55,57.65 50.76,56.44 50.76,55.17 49.61,54.03 42.74,54.03 42.5,54.27 42.5,54.84
$1N2024 on Top Layer: 47.34,21.27 51.57,21.27 52.78,20.07 52.78,18.79 51.64,17.65 44.77,17.65 44.53,17.89 44.53,18.46
$1N7133 on Top Layer: 10.62,19.24 13.34,19.24 14.94,17.65 14.94,7.62 12.14,4.83 8.46,4.83 6.17,7.11 6.17,13.24 9.85,16.92 9.85,18.48

Small or netless copper shapes (teardrops, artwork), in the pictures only: 1 on Top Layer

## Text on the board
Top Layer: 代鹏涛 申杰文 | 宛陵毕方 | 2024/7/10
Top Silkscreen Layer: GND | VSTEER | 5V | 3V3_A | VBAT | VABT
